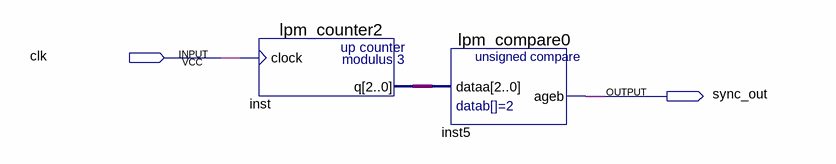
[diagram p0: schematic sheet]
// Quartus schematic single_pulse.bdf as structural Verilog: 2 symbols, 2 pins
module single_pulse (
  input  clk,
  output sync_out
);

  wire [2:0] inst_q;

  lpm_counter2 inst (.clock(clk), .q(inst_q));
  lpm_compare0 inst5 (.dataa(inst_q), .ageb(sync_out));
endmodule
